# Altium project MosaicBus.PrjPcb
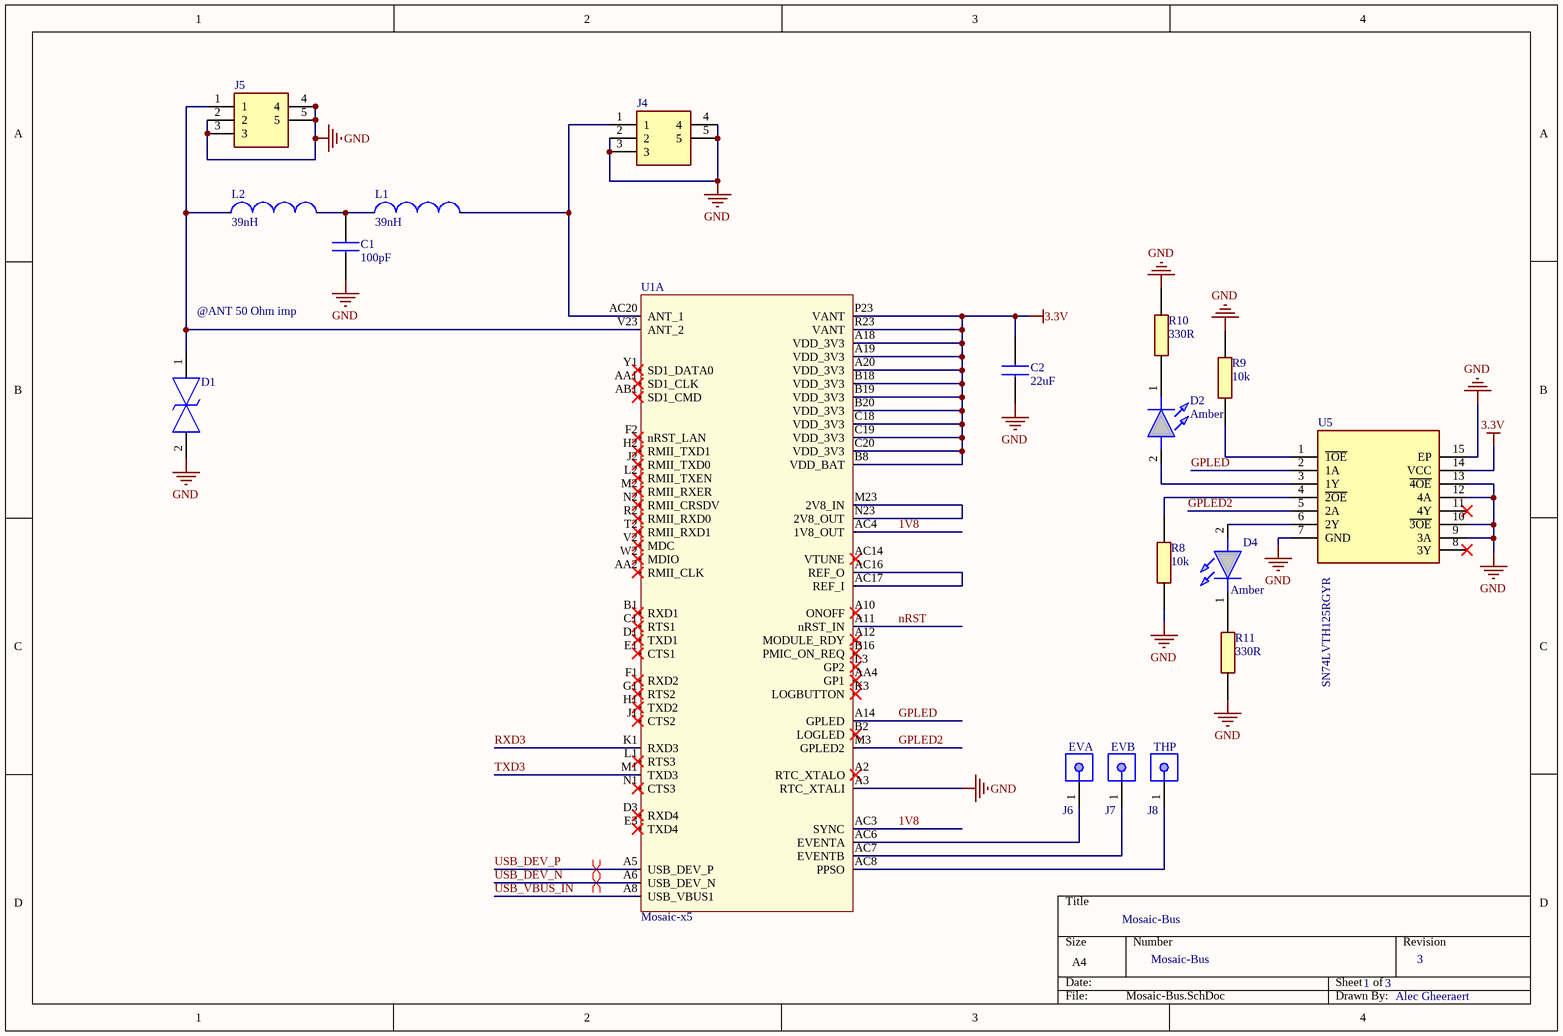
[diagram p0: Mosaic-Bus.SchDoc]
3 sheets, 36 parts. Net scope: global (net labels, ports and power ports of the same name join across sheets).
Board file: Mosaic-Bus.PcbDoc
Sheets:
  Mosaic-Bus.SchDoc
  Mosaic-Support.SchDoc
  Power-Connectors.SchDoc

## Sheet Mosaic-Bus.SchDoc
size A4; SheetNumber: 1; SheetTotal: 3

### Parts
C1  100pF  [CAPC0603X35N]
C2  22uF  [CAPC2012X145N]
D1  TPD1E0B04DPYR  [TPD1E0B04DPYR]  (value not drawn)
D2  Amber  [155060AS75300]
D4  Amber  [155060AS75300]
J4  73415-1472  [MMCX-734151472]  (value not drawn)
J5  73415-1472  [MMCX-734151472]  (value not drawn)
J6  EVA  [TECO-5-146280-2_V]
J7  EVB  [TECO-5-146280-2_V]
J8  THP  [TECO-5-146280-2_V]
L1  39nH  [744786139A]
L2  39nH  [744786139A]
R8  10k  [RESC1608X60N]
R9  10k  [RESC1608X60N]
R10  330R  [RESC1608X60N]
R11  330R  [RESC1608X60N]
U1  Mosaic-x5  [Mosaic-x5]  (part A of 3)
U5  SN74LVTH125RGYR  [QFN50P350X350X100-15N-D]

### Nets
3.3V: C2.1 U1.A18(VDD_3V3) U1.A19(VDD_3V3) U1.A20(VDD_3V3) U1.B8(VDD_BAT) U1.B18(VDD_3V3) U1.B19(VDD_3V3) U1.B20(VDD_3V3) U1.C18(VDD_3V3) U1.C19(VDD_3V3) U1.C20(VDD_3V3) U1.P23(VANT) U1.R23(VANT) U5.14(VCC)
GND: C1.1 C2.2 D1.2 J4.2 J4.3 J4.4 J4.5 J5.2 J5.3 J5.4 J5.5 R8.2 R9.2 R10.2 R11.1 U1.A3(RTC_XTALI) U5.7(GND) U5.9(3A) U5.10(~{3OE}) U5.12(4A) U5.13(~{4OE}) U5.15(EP)
1V8: U1.AC3(SYNC) U1.AC4(1V8_OUT)
GPLED: U1.A14(GPLED) U5.2(1A)
GPLED2: U1.M3(GPLED2) U5.5(2A)
nRST: U1.A11(nRST_IN)
RXD3: U1.K1(RXD3)
TXD3: U1.M1(TXD3)
USB_DEV_N: U1.A6(USB_DEV_N)
USB_DEV_P: U1.A5(USB_DEV_P)
USB_VBUS_IN: U1.A8(USB_VBUS1)
NetC1_2: C1.2 L1.2 L2.1
NetD1_1: D1.1 J5.1 L2.2 U1.V23(ANT_2)
NetD2_1: D2.1(K) R10.1
NetD2_2: D2.2(A) U5.3(1Y)
NetD4_1: D4.1(K) R11.2
NetD4_2: D4.2(A) U5.6(2Y)
NetJ4_1: J4.1 L1.1 U1.AC20(ANT_1)
NetJ6_1: J6.1 U1.AC6(EVENTA)
NetJ7_1: J7.1 U1.AC7(EVENTB)
NetJ8_1: J8.1 U1.AC8(PPSO)
NetR8_1: R8.1 U5.4(~{2OE})
NetR9_1: R9.1 U5.1(~{1OE})
NetU1_AC16: U1.AC16(REF_O) U1.AC17(REF_I)
NetU1_M23: U1.M23(2V8_IN) U1.N23(2V8_OUT)

Not connected (* = marked no-connect by the designer): U1 A2(RTC_XTALO)* A10(ONOFF)* A12(MODULE_RDY)* AA1(SD1_CLK)* AA2(RMII_CLK)* AA4(GP1)* AB1(SD1_CMD)* AC14(VTUNE)* B1(RXD1)* B2(LOGLED)* B16(PMIC_ON_REQ)* C1(RTS1)* D1(TXD1)* D3(RXD4)* E1(CTS1)* E3(TXD4)* F1(RXD2)* F2(nRST_LAN)* G1(RTS2)* H1(TXD2)* H2(RMII_TXD1)* J1(CTS2)* J2(RMII_TXD0)* K3(LOGBUTTON)* L1(RTS3)* L2(RMII_TXEN)* L3(GP2)* M2(RMII_RXER)* N1(CTS3)* N2(RMII_CRSDV)* R2(RMII_RXD0)* T2(RMII_RXD1)* V2(MDC)* W2(MDIO)* Y1(SD1_DATA0)*; U5 8(3Y)* 11(4Y)*

### Layout directives
differential pair: USB_DEV_N, USB_DEV_P

### Notes on the sheet
- @ANT 50 Ohm imp
- Mosaic-Bus
- 1
- 3
- Alec Gheeraert

### Library data of the parts
C1 = CMP-013-000003-3: 100pF Capacitor; Manufacturer: Walsin; VoltageRating: 25V; Dielectric: C0G; Tolerance: 5%; Capacitance: 100pF; Size: 0603
C2 = CMP-013-000005-3: 22uF Capacitor; Manufacturer: Walsin; Dielectric: X5R; Capacitance: 22µF; Tolerance: 10%; VoltageRating: 6.3V; Size: 2012
D1 = CMP-019-000007-3: TVS Diode Bidirectional 1-Channel; Manufacturer: Texas Instruments; Type: TVS Diode
D2 D4 = CMP-00011-4: Amber LED; Manufacturer: Wurth Elektronik; ForwardCurrent: 2A; ForwardVoltage: 20mV; Size: 1608; Color: Amber
J4 J5 = CMP-007-000002-4: MMCX Connector; Manufacturer: Molex
J6-J8 = CMP-00010-1: Through hole pin
L1 L2 = CMP-00001-4: 39nH Inductor; Manufacturer: Wurth Elektronik; Frequency: 1.4GHz; Tolerance: 5%; Shielding: Shielded; Inductance: 39nH; Size: 1608
R8 R9 = CMP-052-000001-5: 10kOhm Resistor; Manufacturer: Walsin; VoltageRating: 50V; Tolerance: 5%; PowerRating: 100mW; Size: 1608; Resistance: 10k
R10 R11 = CMP-00017-2: 330Ohm Resistor; Manufacturer: Walsin; Resistance: 330; Tolerance: 5%; PowerRating: 100mW; VoltageRating: 50V; Size: 1608
U1 = CP-Mosaic-x5-7: Septentrio Mosaic x5
U5 = CMP-00009-5: 3-State Output Driver; Manufacturer: Texas Instruments; Supply Voltage: 3.3V; Inputs: 4; Output Current: 64mA; Outputs: 3; Case: VQFN-14

## Sheet Mosaic-Support.SchDoc
size A4; SheetNumber: 2; SheetTotal: 2
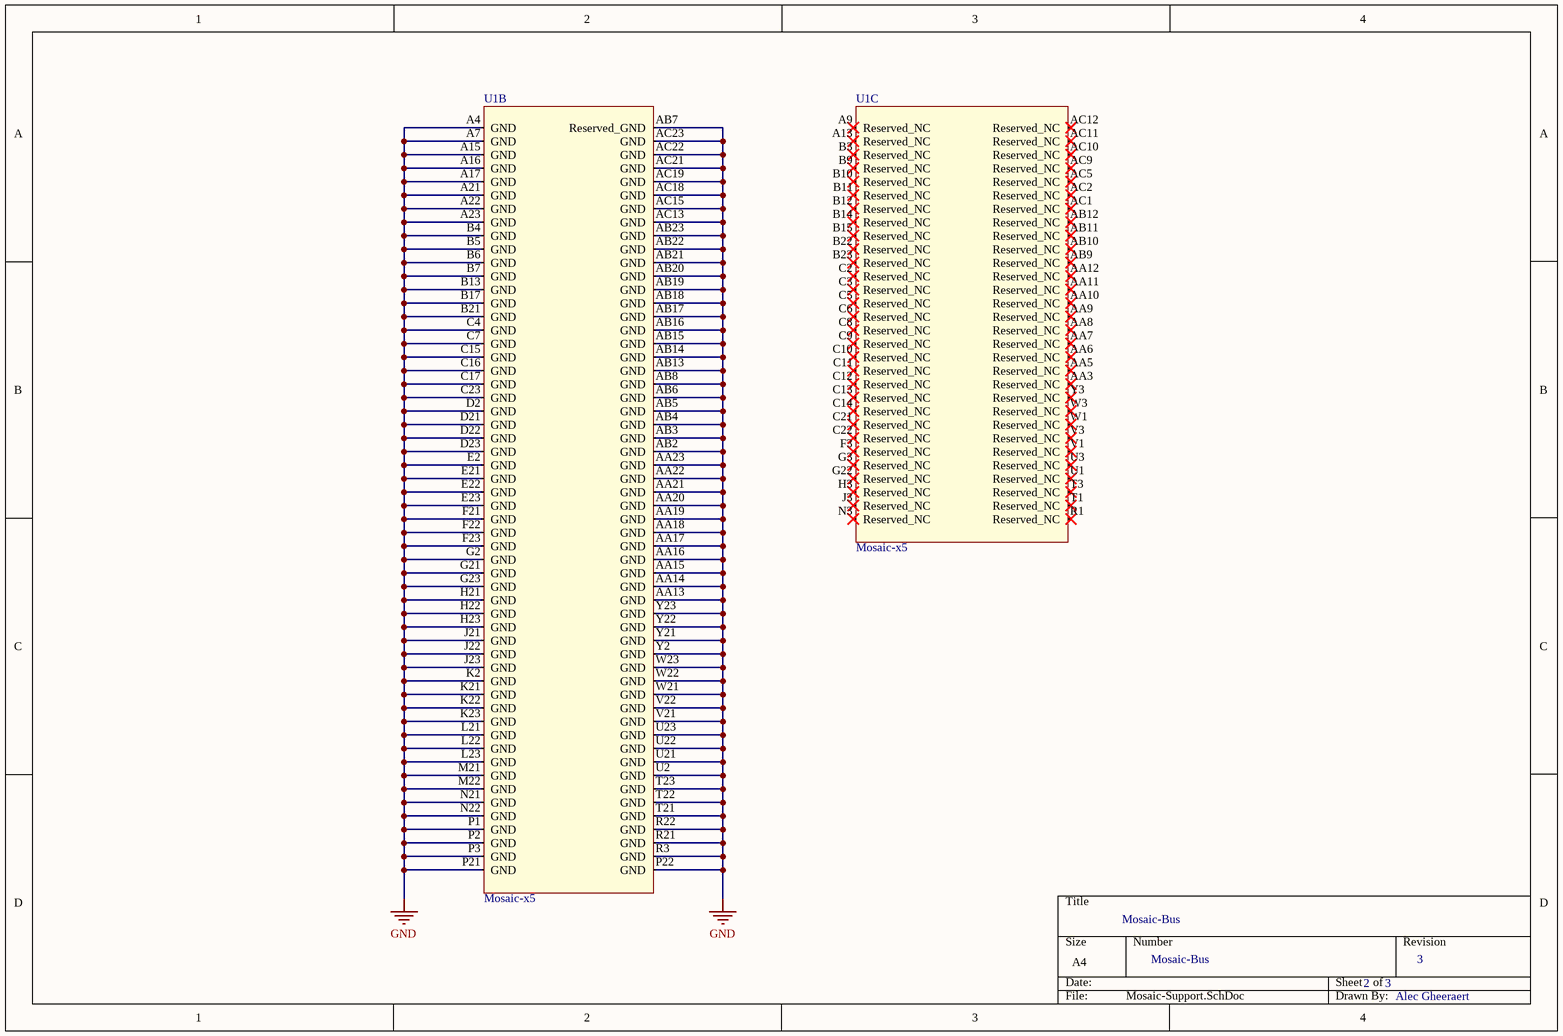
[diagram p1: Mosaic-Support.SchDoc]

### Parts
U1  Mosaic-x5  [Mosaic-x5]  (parts B,C of 3)

### Nets
GND: U1.A4(GND) U1.A7(GND) U1.A15(GND) U1.A16(GND) U1.A17(GND) U1.A21(GND) U1.A22(GND) U1.A23(GND) U1.AA13(GND) U1.AA14(GND) U1.AA15(GND) U1.AA16(GND) U1.AA17(GND) U1.AA18(GND) U1.AA19(GND) U1.AA20(GND) U1.AA21(GND) U1.AA22(GND) U1.AA23(GND) U1.AB2(GND) U1.AB3(GND) U1.AB4(GND) U1.AB5(GND) U1.AB6(GND) U1.AB7(Reserved_GND) U1.AB8(GND) U1.AB13(GND) U1.AB14(GND) U1.AB15(GND) U1.AB16(GND) U1.AB17(GND) U1.AB18(GND) U1.AB19(GND) U1.AB20(GND) U1.AB21(GND) U1.AB22(GND) U1.AB23(GND) U1.AC13(GND) U1.AC15(GND) U1.AC18(GND) U1.AC19(GND) U1.AC21(GND) U1.AC22(GND) U1.AC23(GND) U1.B4(GND) U1.B5(GND) U1.B6(GND) U1.B7(GND) U1.B13(GND) U1.B17(GND) U1.B21(GND) U1.C4(GND) U1.C7(GND) U1.C15(GND) U1.C16(GND) U1.C17(GND) U1.C23(GND) U1.D2(GND) U1.D21(GND) U1.D22(GND) U1.D23(GND) U1.E2(GND) U1.E21(GND) U1.E22(GND) U1.E23(GND) U1.F21(GND) U1.F22(GND) U1.F23(GND) U1.G2(GND) U1.G21(GND) U1.G23(GND) U1.H21(GND) U1.H22(GND) U1.H23(GND) U1.J21(GND) U1.J22(GND) U1.J23(GND) U1.K2(GND) U1.K21(GND) U1.K22(GND) U1.K23(GND) U1.L21(GND) U1.L22(GND) U1.L23(GND) U1.M21(GND) U1.M22(GND) U1.N21(GND) U1.N22(GND) U1.P1(GND) U1.P2(GND) U1.P3(GND) U1.P21(GND) U1.P22(GND) U1.R3(GND) U1.R21(GND) U1.R22(GND) U1.T21(GND) U1.T22(GND) U1.T23(GND) U1.U2(GND) U1.U21(GND) U1.U22(GND) U1.U23(GND) U1.V21(GND) U1.V22(GND) U1.W21(GND) U1.W22(GND) U1.W23(GND) U1.Y2(GND) U1.Y21(GND) U1.Y22(GND) U1.Y23(GND)

Not connected (* = marked no-connect by the designer): U1 A9(Reserved_NC)* A13(Reserved_NC)* AA3(Reserved_NC)* AA5(Reserved_NC)* AA6(Reserved_NC)* AA7(Reserved_NC)* AA8(Reserved_NC)* AA9(Reserved_NC)* AA10(Reserved_NC)* AA11(Reserved_NC)* AA12(Reserved_NC)* AB9(Reserved_NC)* AB10(Reserved_NC)* AB11(Reserved_NC)* AB12(Reserved_NC)* AC1(Reserved_NC)* AC2(Reserved_NC)* AC5(Reserved_NC)* AC9(Reserved_NC)* AC10(Reserved_NC)* AC11(Reserved_NC)* AC12(Reserved_NC)* B3(Reserved_NC)* B9(Reserved_NC)* B10(Reserved_NC)* B11(Reserved_NC)* B12(Reserved_NC)* B14(Reserved_NC)* B15(Reserved_NC)* B22(Reserved_NC)* B23(Reserved_NC)* C2(Reserved_NC)* C3(Reserved_NC)* C5(Reserved_NC)* C6(Reserved_NC)* C8(Reserved_NC)* C9(Reserved_NC)* C10(Reserved_NC)* C11(Reserved_NC)* C12(Reserved_NC)* C13(Reserved_NC)* C14(Reserved_NC)* C21(Reserved_NC)* C22(Reserved_NC)* F3(Reserved_NC)* G3(Reserved_NC)* G22(Reserved_NC)* H3(Reserved_NC)* J3(Reserved_NC)* N3(Reserved_NC)* R1(Reserved_NC)* T1(Reserved_NC)* T3(Reserved_NC)* U1(Reserved_NC)* U3(Reserved_NC)* V1(Reserved_NC)* V3(Reserved_NC)* W1(Reserved_NC)* W3(Reserved_NC)* Y3(Reserved_NC)*

### Notes on the sheet
- Mosaic-Bus
- 2
- 3
- Alec Gheeraert

### Library data of the parts
U1 = CP-Mosaic-x5-7: Septentrio Mosaic x5

## Sheet Power-Connectors.SchDoc
size A4; SheetNumber: 3; SheetTotal: 3
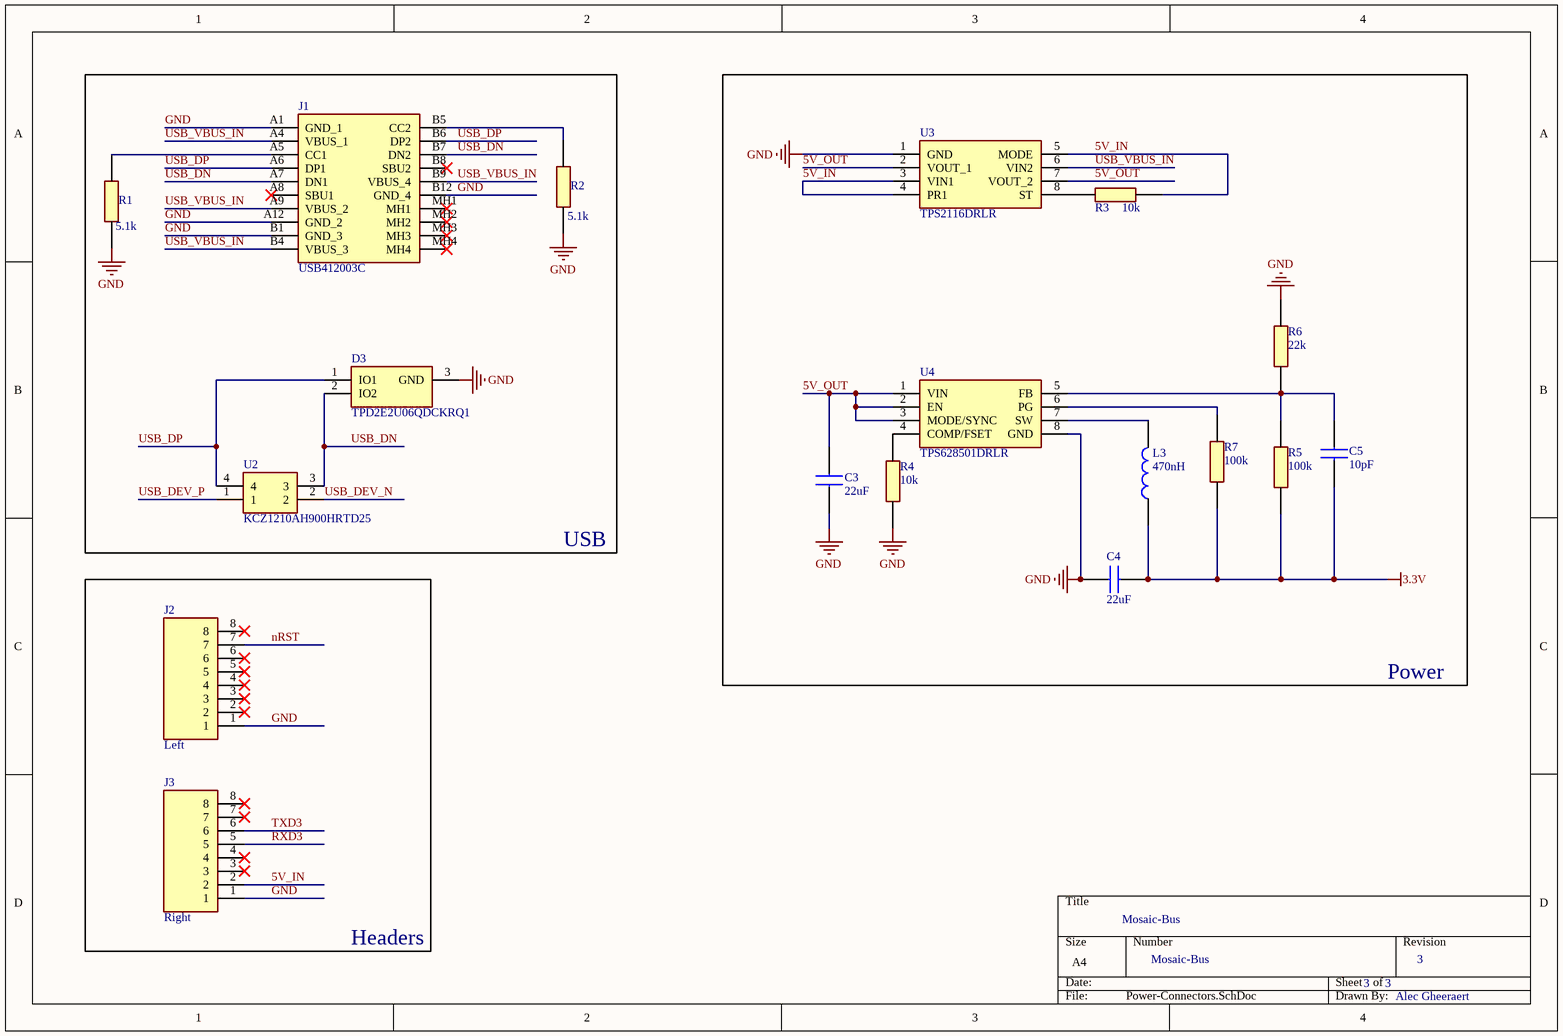
[diagram p2: Power-Connectors.SchDoc]

### Parts
C3  22uF  [CAPC3317X190N]
C4  22uF  [CAPC3317X190N]
C5  10pF  [CAPC1608X95N]
D3  TPD2E2U06QDCKRQ1  [TPD2E2U06QDCKRQ1]
J1  USB412003C  [USB412003C]
J2  Left  [HDRV8W63P0X254_1X8_2032X254X970P]
J3  Right  [HDRV8W63P0X254_1X8_2032X254X970P]
L3  470nH  [INDC2016X100N]
R1  5.1k  [RESC1608X60N]
R2  5.1k  [RESC1608X60N]
R3  10k  [RESC1608X60N]
R4  10k  [RESC1608X60N]
R5  100k  [RESC1608X60N]
R6  22k  [RESC1608X60N]
R7  100k  [RESC1608X60N]
U2  KCZ1210AH900HRTD25  [KCZ1210AH900HRTD25]
U3  TPS2116DRLR  [TPS2116DRLR]
U4  TPS628501DRLR  [TPS628501DRLR]

### Blocks framed on the sheet
USB: D3 J1 R1 R2 U2
Power: C3-C5 L3 R3-R7 U3 U4
Headers: J2 J3

### Nets
3.3V: C4.1 C5.2 L3.1 R5.2 R7.2
GND: C3.1 C4.2 D3.3(GND) J1.A1(GND_1) J1.A12(GND_2) J1.B1(GND_3) J1.B12(GND_4) J2.1 J3.1 R1.2 R2.2 R4.2 R6.1 U3.1(GND) U4.8(GND)
5V_IN: J3.2 R3.2 U3.3(VIN1) U3.4(PR1) U3.5(MODE)
5V_OUT: C3.2 U3.2(VOUT_1) U3.7(VOUT_2) U4.1(VIN) U4.2(EN) U4.3(MODE/SYNC)
nRST: J2.7
RXD3: J3.5
TXD3: J3.6
USB_DEV_N: U2.2
USB_DEV_P: U2.1
USB_DN: D3.2(IO2) J1.A7(DN1) J1.B7(DN2) U2.3
USB_DP: D3.1(IO1) J1.A6(DP1) J1.B6(DP2) U2.4
USB_VBUS_IN: J1.A4(VBUS_1) J1.A9(VBUS_2) J1.B4(VBUS_3) J1.B9(VBUS_4) U3.6(VIN2)
NetC5_1: C5.1 R5.1 R6.2 U4.5(FB)
NetJ1_A5: J1.A5(CC1) R1.1
NetJ1_B5: J1.B5(CC2) R2.1
NetL3_2: L3.2 U4.7(SW)
NetR3_1: R3.1 U3.8(ST)
NetR4_1: R4.1 U4.4(COMP/FSET)
NetR7_1: R7.1 U4.6(PG)

Not connected (* = marked no-connect by the designer): J1 A8(SBU1)* B8(SBU2)* MH1* MH2* MH3* MH4*; J2 2* 3* 4* 5* 6* 8*; J3 3* 4* 7* 8*

### Notes on the sheet
- Mosaic-Bus
- 3
- Alec Gheeraert

### Library data of the parts
C3 C4 = CMP-00015-2: 22uF Capacitor; Manufacturer: Walsin; Capacitance: 22µF; Dielectric: X5R; Tolerance: 10%; VoltageRating: 16V; Size: 3216
C5 = CMP-00005-3: 10pF Capacitor; Manufacturer: Walsin; VoltageRating: 100V; Tolerance: 1%; Dielectric: C0G; Size: 1608; Capacitance: 10pF
D3 = CMP-019-000005-5: TVS Diode Unidirectional 2-Channel; Manufacturer: Texas Instruments; Type: TVS Diode
J1 = CMP-002-000001-6: USB-C Connector 16P Vertical; Manufacturer: Global Connector Technology; Type: USB
J2 J3 = CMP-007-000003-3: Headers & Wire Housings 8P SINGLE ROW
L3 = CMP-00006-6: 470nH Inductor; Manufacturer: Wurth Elektronik; Tolerance: 30%; Frequency: 175MHz; Shielding: Shielded; Size: 2016; Inductance: 470nH
R1 R2 = CMP-052-000000-4: 5.1kOhm Resistor; Manufacturer: Walsin; VoltageRating: 50V; Tolerance: 1%; PowerRating: 100mW; Size: 1608; Resistance: 5.1k
R3 R4 = CMP-052-000001-5: as R8 on sheet Mosaic-Bus; Resistance: 10k; Size: 1608
R5 R7 = CMP-00007-4: 100kOhm Resistor; Manufacturer: Walsin; Tolerance: 5%; PowerRating: 100mW; VoltageRating: 50V; Resistance: 100k; Size: 1608
R6 = CMP-00008-4: 22kOhm Resistor; Manufacturer: Walsin; Tolerance: 5%; VoltageRating: 50V; PowerRating: 100mW; Resistance: 22k; Size: 1608
U2 = CMP-016-000001-3: Common Mode Filters / Chokes,
U3 = CMP-031-000003-8: Power Multiplexer 1 Output 1.6V-5.5V 2.5A; Manufacturer: Texas Instruments; Type: Power Multiplexer
U4 = CMP-031-000004-6: Switching Voltage Regulator Buck 600mV-5.5V 1A; Manufacturer: Texas Instruments; Type: Switching Voltage Regulator

## Nets that join several sheets
3.3V: Mosaic-Bus (14 pins), Power-Connectors (5 pins)
GND: Mosaic-Bus (22 pins), Mosaic-Support (112 pins), Power-Connectors (15 pins)
nRST: Mosaic-Bus (U1.A11), Power-Connectors (J2.7)
RXD3: Mosaic-Bus (U1.K1), Power-Connectors (J3.5)
TXD3: Mosaic-Bus (U1.M1), Power-Connectors (J3.6)
USB_DEV_N: Mosaic-Bus (U1.A6), Power-Connectors (U2.2)
USB_DEV_P: Mosaic-Bus (U1.A5), Power-Connectors (U2.1)
USB_VBUS_IN: Mosaic-Bus (U1.A8), Power-Connectors (5 pins)